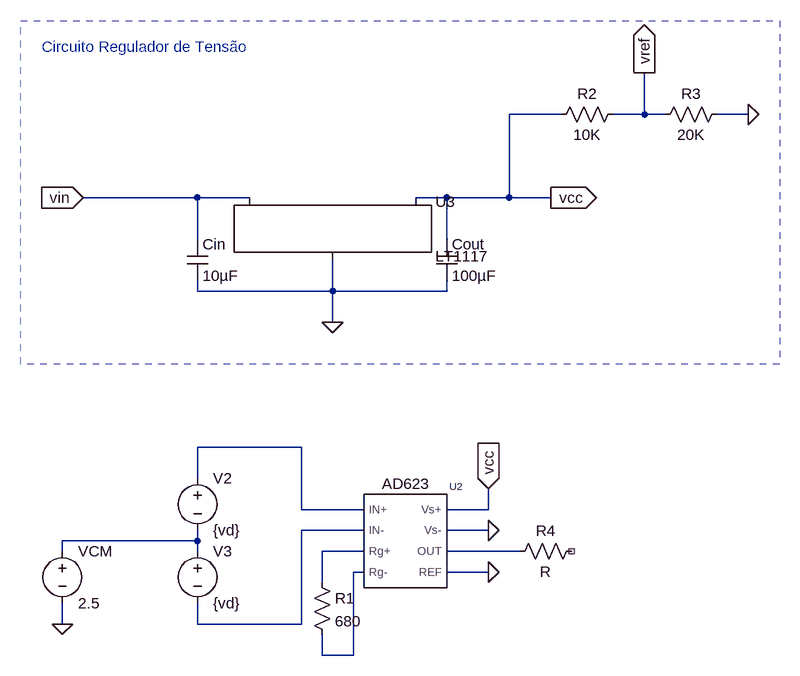
[diagram p0: schematic BalancaCircuito.asc]
BalancaCircuito.asc, the LTspice schematic file:
Version 4
SHEET 1 1092 680
WIRE 592 -480 512 -480
WIRE 720 -480 720 -544
WIRE 720 -480 672 -480
WIRE 752 -480 720 -480
WIRE 880 -480 832 -480
WIRE 32 -352 -144 -352
WIRE 112 -352 32 -352
WIRE 416 -352 368 -352
WIRE 512 -352 512 -480
WIRE 512 -352 416 -352
WIRE 576 -352 512 -352
WIRE 32 -288 32 -352
WIRE 416 -288 416 -352
WIRE 32 -208 32 -224
WIRE 240 -208 240 -256
WIRE 240 -208 32 -208
WIRE 416 -208 416 -224
WIRE 416 -208 240 -208
WIRE 240 -160 240 -208
WIRE 192 32 32 32
WIRE 32 80 32 32
WIRE 192 128 192 32
WIRE 288 128 192 128
WIRE 480 128 480 96
WIRE 480 128 416 128
WIRE 288 160 192 160
WIRE 480 160 416 160
WIRE 32 176 32 160
WIRE 32 176 -176 176
WIRE -176 192 -176 176
WIRE 32 192 32 176
WIRE 288 192 224 192
WIRE 528 192 416 192
WIRE 288 224 272 224
WIRE 480 224 416 224
WIRE 224 240 224 192
WIRE -176 304 -176 272
WIRE 32 304 32 272
WIRE 192 304 192 160
WIRE 192 304 32 304
WIRE 224 352 224 320
WIRE 272 352 272 224
WIRE 272 352 224 352
FLAG -176 304 0
FLAG 240 -160 0
FLAG -144 -352 vin
IOPIN -144 -352 In
FLAG 480 160 0
FLAG 480 96 vcc
IOPIN 480 96 In
FLAG 576 -352 vcc
IOPIN 576 -352 Out
FLAG 880 -480 0
FLAG 720 -544 vref
IOPIN 720 -544 Out
FLAG 480 224 0
SYMBOL voltage -176 176 R0
SYMATTR InstName VCM
SYMATTR Value 2.5
SYMBOL voltage 32 64 R0
SYMATTR InstName V2
SYMATTR Value {vd}
SYMBOL voltage 32 176 R0
SYMATTR InstName V3
SYMATTR Value {vd}
SYMBOL cap 16 -288 R0
SYMATTR InstName Cin
SYMATTR Value 10µF
SYMBOL cap 400 -288 R0
SYMATTR InstName Cout
SYMATTR Value 100µF
SYMBOL AD623 352 176 R0
SYMATTR InstName U2
SYMBOL res 208 224 R0
SYMATTR InstName R1
SYMATTR Value 680
SYMBOL res 688 -496 R90
WINDOW 0 0 56 VBottom 2
WINDOW 3 32 56 VTop 2
SYMATTR InstName R2
SYMATTR Value 10K
SYMBOL res 848 -496 R90
WINDOW 0 0 56 VBottom 2
WINDOW 3 32 56 VTop 2
SYMATTR InstName R3
SYMATTR Value 20K
SYMBOL res 624 176 R90
WINDOW 0 0 56 VBottom 2
WINDOW 3 32 56 VTop 2
SYMATTR InstName R4
SYMBOL PowerProducts\\LT1117 240 -352 R0
SYMATTR InstName U3
TEXT -208 -584 Left 2 ;Circuito Regulador de Tensão
RECTANGLE Normal 928 -96 -240 -624 1

The netlist it stands for:
* BalancaCircuito.asc
VCM N003 0 2.5
V2 N001 N003 {vd}
V3 N003 N002 {vd}
Cin vin 0 10µF
Cout vcc 0 100µF
XU2 N001 N002 N004 N006 vcc 0 N005 0 AD623  ; pins IN+ IN- Rg+ Rg- Vs+ Vs- OUT REF
R1 N004 N006 680
R2 vref vcc 10K
R3 0 vref 20K
R4 NC_01 N005 R
XU3 0 vcc vin LT1117
* Circuito Regulador de Tensão
.lib ad623.cir
.lib LT1117.lib
.backanno
.end